# Altium project NRF52832_MODULE_V1.0_D.PrjPcb
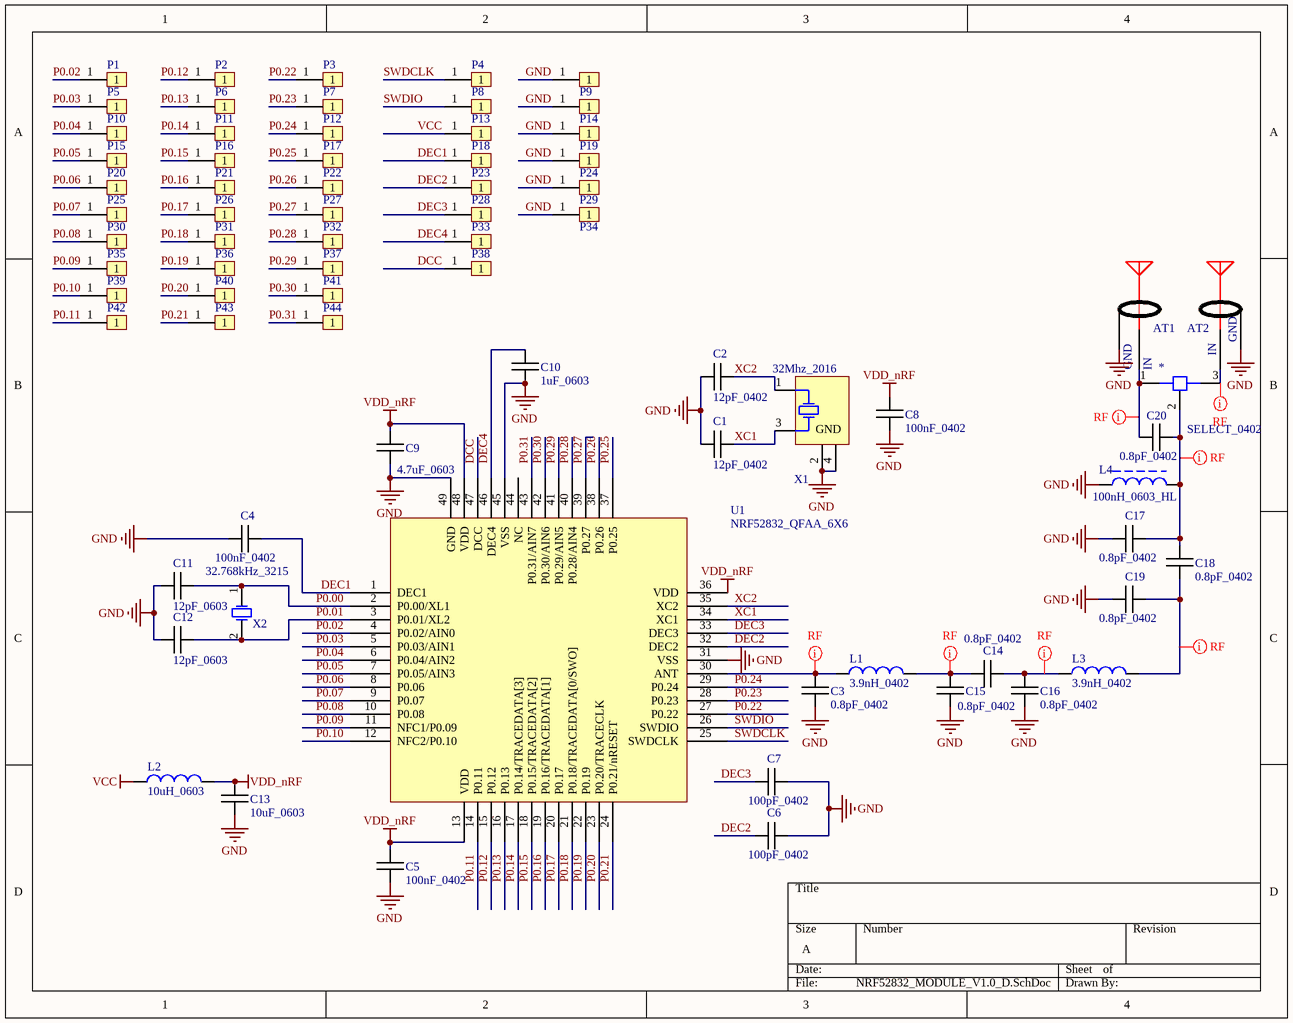
[diagram p0: NRF52832_MODULE_V1.0_D.SchDoc]
1 sheet, 74 parts. Net scope: global (net labels, ports and power ports of the same name join across sheets).
Board file: NRF52832_MODULE_V1.0_D.PcbDoc

## Sheet NRF52832_MODULE_V1.0_D.SchDoc
size A; SheetNumber: 1; SheetTotal: 1

### Parts
*  SELECT_0402  [PAD 0402_SELECT]
AT1  ANTEN_PCB  [ANTEN_PCB_15MM_L]  (value not drawn)
AT2  IPX_KK23011-32-7H  [IPEX_ANTENNA]  (value not drawn)
C1  12pF_0402  [CAP 0402]
C2  12pF_0402  [CAP 0402]
C3  0.8pF_0402  [CAP 0402]
C4  100nF_0402  [CAP 0402]
C5  100nF_0402  [CAP 0402]
C6  100pF_0402  [CAP 0402]
C7  100pF_0402  [CAP 0402]
C8  100nF_0402  [CAP 0402]
C9  4.7uF_0603  [CAP 0603]
C10  1uF_0603  [CAP 0603]
C11  12pF_0603  [CAP 0402]
C12  12pF_0603  [CAP 0402]
C13  10uF_0603  [CAP 0603]
C14  0.8pF_0402  [CAP 0402]
C15  0.8pF_0402  [CAP 0402]
C16  0.8pF_0402  [CAP 0402]
C17  0.8pF_0402  [CAP 0402]
C18  0.8pF_0402  [CAP 0402]
C19  0.8pF_0402  [CAP 0402]
C20  0.8pF_0402  [CAP 0402]
L1  3.9nH_0402  [Inductor 0402]
L2  10uH_0603  [INDUCTOR 0603]
L3  3.9nH_0402  [Inductor 0402]
L4  100nH_0603_HL  [INDUCTOR 0603_HL]
P1  Half-hole 0.6mm  [HALF-HOLE_0.6MM]  (value not drawn)
P2  Half-hole 0.6mm  [HALF-HOLE_0.6MM]  (value not drawn)
P3  Half-hole 0.6mm  [HALF-HOLE_0.6MM]  (value not drawn)
P4  Half-hole 0.6mm  [HALF-HOLE_0.6MM]  (value not drawn)
P5  Half-hole 0.6mm  [HALF-HOLE_0.6MM]  (value not drawn)
P6  Half-hole 0.6mm  [HALF-HOLE_0.6MM]  (value not drawn)
P7  Half-hole 0.6mm  [HALF-HOLE_0.6MM]  (value not drawn)
P8  Half-hole 0.6mm  [HALF-HOLE_0.6MM]  (value not drawn)
P9  Half-hole 0.6mm  [HALF-HOLE_0.6MM]  (value not drawn)
P10  Half-hole 0.6mm  [HALF-HOLE_0.6MM]  (value not drawn)
P11  Half-hole 0.6mm  [HALF-HOLE_0.6MM]  (value not drawn)
P12  Half-hole 0.6mm  [HALF-HOLE_0.6MM]  (value not drawn)
P13  Half-hole 0.6mm  [HALF-HOLE_0.6MM]  (value not drawn)
P14  Half-hole 0.6mm  [HALF-HOLE_0.6MM]  (value not drawn)
P15  Half-hole 0.6mm  [HALF-HOLE_0.6MM]  (value not drawn)
P16  Half-hole 0.6mm  [HALF-HOLE_0.6MM]  (value not drawn)
P17  Half-hole 0.6mm  [HALF-HOLE_0.6MM]  (value not drawn)
P18  Half-hole 0.6mm  [HALF-HOLE_0.6MM]  (value not drawn)
P19  Half-hole 0.6mm  [HALF-HOLE_0.6MM]  (value not drawn)
P20  Half-hole 0.6mm  [HALF-HOLE_0.6MM]  (value not drawn)
P21  Half-hole 0.6mm  [HALF-HOLE_0.6MM]  (value not drawn)
P22  Half-hole 0.6mm  [HALF-HOLE_0.6MM]  (value not drawn)
P23  Half-hole 0.6mm  [HALF-HOLE_0.6MM]  (value not drawn)
P24  Half-hole 0.6mm  [HALF-HOLE_0.6MM]  (value not drawn)
P25  Half-hole 0.6mm  [HALF-HOLE_0.6MM]  (value not drawn)
P26  Half-hole 0.6mm  [HALF-HOLE_0.6MM]  (value not drawn)
P27  Half-hole 0.6mm  [HALF-HOLE_0.6MM]  (value not drawn)
P28  Half-hole 0.6mm  [HALF-HOLE_0.6MM]  (value not drawn)
P29  Half-hole 0.6mm  [HALF-HOLE_0.6MM]  (value not drawn)
P30  Half-hole 0.6mm  [HALF-HOLE_0.6MM]  (value not drawn)
P31  Half-hole 0.6mm  [HALF-HOLE_0.6MM]  (value not drawn)
P32  Half-hole 0.6mm  [HALF-HOLE_0.6MM]  (value not drawn)
P33  Half-hole 0.6mm  [HALF-HOLE_0.6MM]  (value not drawn)
P34  Half-hole 0.6mm  [HALF-HOLE_0.6MM]  (value not drawn)
P35  Half-hole 0.6mm  [HALF-HOLE_0.6MM]  (value not drawn)
P36  Half-hole 0.6mm  [HALF-HOLE_0.6MM]  (value not drawn)
P37  Half-hole 0.6mm  [HALF-HOLE_0.6MM]  (value not drawn)
P38  Half-hole 0.6mm  [HALF-HOLE_0.6MM]  (value not drawn)
P39  Half-hole 0.6mm  [HALF-HOLE_0.6MM]  (value not drawn)
P40  Half-hole 0.6mm  [HALF-HOLE_0.6MM]  (value not drawn)
P41  Half-hole 0.6mm  [HALF-HOLE_0.6MM]  (value not drawn)
P42  Half-hole 0.6mm  [HALF-HOLE_0.6MM]  (value not drawn)
P43  Half-hole 0.6mm  [HALF-HOLE_0.6MM]  (value not drawn)
P44  Half-hole 0.6mm  [HALF-HOLE_0.6MM]  (value not drawn)
U1  NRF52832_QFAA_6X6  [QFN48_6X6]
X1  32Mhz_2016  [CYSTAL-SMD-2016]
X2  32.768kHz_3215  [CYSTAL-SMD-3215]

### Nets
GND: AT1.2(GND) AT2.2(GND) C1.1 C2.1 C3.1 C4.1 C5.1 C6.2 C7.2 C8.1 C9.1 C10.1 C11.2 C12.2 C13.1 C15.1 C16.1 C17.1 C19.1 L4.1 P9.1 P14.1 P19.1 P24.1 P29.1 P34.1 U1.31(VSS) U1.45(VSS) U1.49(GND) X1.2(GND) X1.4(GND)
VCC: L2.1 P13.1
VDD_nRF: C5.2 C8.2 C9.2 C13.2 L2.2 U1.13(VDD) U1.36(VDD) U1.48(VDD)
DCC: P38.1 U1.47(DCC)
DEC1: C4.2 P18.1 U1.1(DEC1)
DEC2: C6.1 P23.1 U1.32(DEC2)
DEC3: C7.1 P28.1 U1.33(DEC3)
DEC4: C10.2 P33.1 U1.46(DEC4)
P0.00: C11.1 U1.2(P0.00/XL1) X2.1(XTAL)
P0.01: C12.1 U1.3(P0.01/XL2) X2.2(XTAL)
P0.02: P1.1 U1.4(P0.02/AIN0)
P0.03: P5.1 U1.5(P0.03/AIN1)
P0.04: P10.1 U1.6(P0.04/AIN2)
P0.05: P15.1 U1.7(P0.05/AIN3)
P0.06: P20.1 U1.8(P0.06)
P0.07: P25.1 U1.9(P0.07)
P0.08: P30.1 U1.10(P0.08)
P0.09: P35.1 U1.11(NFC1/P0.09)
P0.10: P39.1 U1.12(NFC2/P0.10)
P0.11: P42.1 U1.14(P0.11)
P0.12: P2.1 U1.15(P0.12)
P0.13: P6.1 U1.16(P0.13)
P0.14: P11.1 U1.17(P0.14/TRACEDATA[3])
P0.15: P16.1 U1.18(P0.15/TRACEDATA[2])
P0.16: P21.1 U1.19(P0.16/TRACEDATA[1])
P0.17: P26.1 U1.20(P0.17)
P0.18: P31.1 U1.21(P0.18/TRACEDATA[0/SWO])
P0.19: P36.1 U1.22(P0.19)
P0.20: P40.1 U1.23(P0.20/TRACECLK)
P0.21: P43.1 U1.24(P0.21/nRESET)
P0.22: P3.1 U1.27(P0.22)
P0.23: P7.1 U1.28(P0.23)
P0.24: P12.1 U1.29(P0.24)
P0.25: P17.1 U1.37(P0.25)
P0.26: P22.1 U1.38(P0.26)
P0.27: P27.1 U1.39(P0.27)
P0.28: P32.1 U1.40(P0.28/AIN4)
P0.29: P37.1 U1.41(P0.29/AIN5)
P0.30: P41.1 U1.42(P0.30/AIN6)
P0.31: P44.1 U1.43(P0.31/AIN7)
SWDCLK: P4.1 U1.25(SWDCLK)
SWDIO: P8.1 U1.26(SWDIO)
XC1: C1.2 U1.34(XC1) X1.3(XTAL)
XC2: C2.2 U1.35(XC2) X1.1(XTAL)
Net*_1: *.1 AT1.1(IN) C20.1
Net*_2: *.2 C17.2 C18.2 C20.2 L4.2
Net*_3: *.3 AT2.1(IN)
NetC3_2: C3.2 L1.1 U1.30(ANT)
NetC14_1: C14.1 C16.2 L3.1
NetC14_2: C14.2 C15.2 L1.2
NetC18_1: C18.1 C19.2 L3.2

Not connected (* = marked no-connect by the designer): U1 44(NC)

### Layout directives
net class RF: Net*_1, Net*_2, Net*_3, NetC3_2, NetC14_1, NetC14_2, NetC18_1

### Library data of the parts
AT1 = ANTEN_PCB: ANTEN_PCB_15MM
AT2 = ANTEN_IPX: ANTEN IPX KK23011-32-7H FOXCONN
C4 C5 C8 = 104_100nF_0402
C6 C7 = 101_100pF_0402
C10 = 105_1uF_0603: 1uF_0603 16V
C11 C12 = 12pF_0402
C13 = 106_10uF_0603: 10uF_0603 16V
L1 L3 = 3.9nH
L4 = 100nH_0603_HL: SDWL1608CR10JSTF Wire Wound Chip Ceramic Inductor
P1-P44 = Half-hole 0.6mm: Part Half-hole 0.6mm
U1 = NRF52832
X1 = Crystal 2016 32MHz: Value: 4Mhz
X2 = Crystal 3215 32.768kHz: Value: 4Mhz